# Altium project central_unit_projekt.PrjPcb
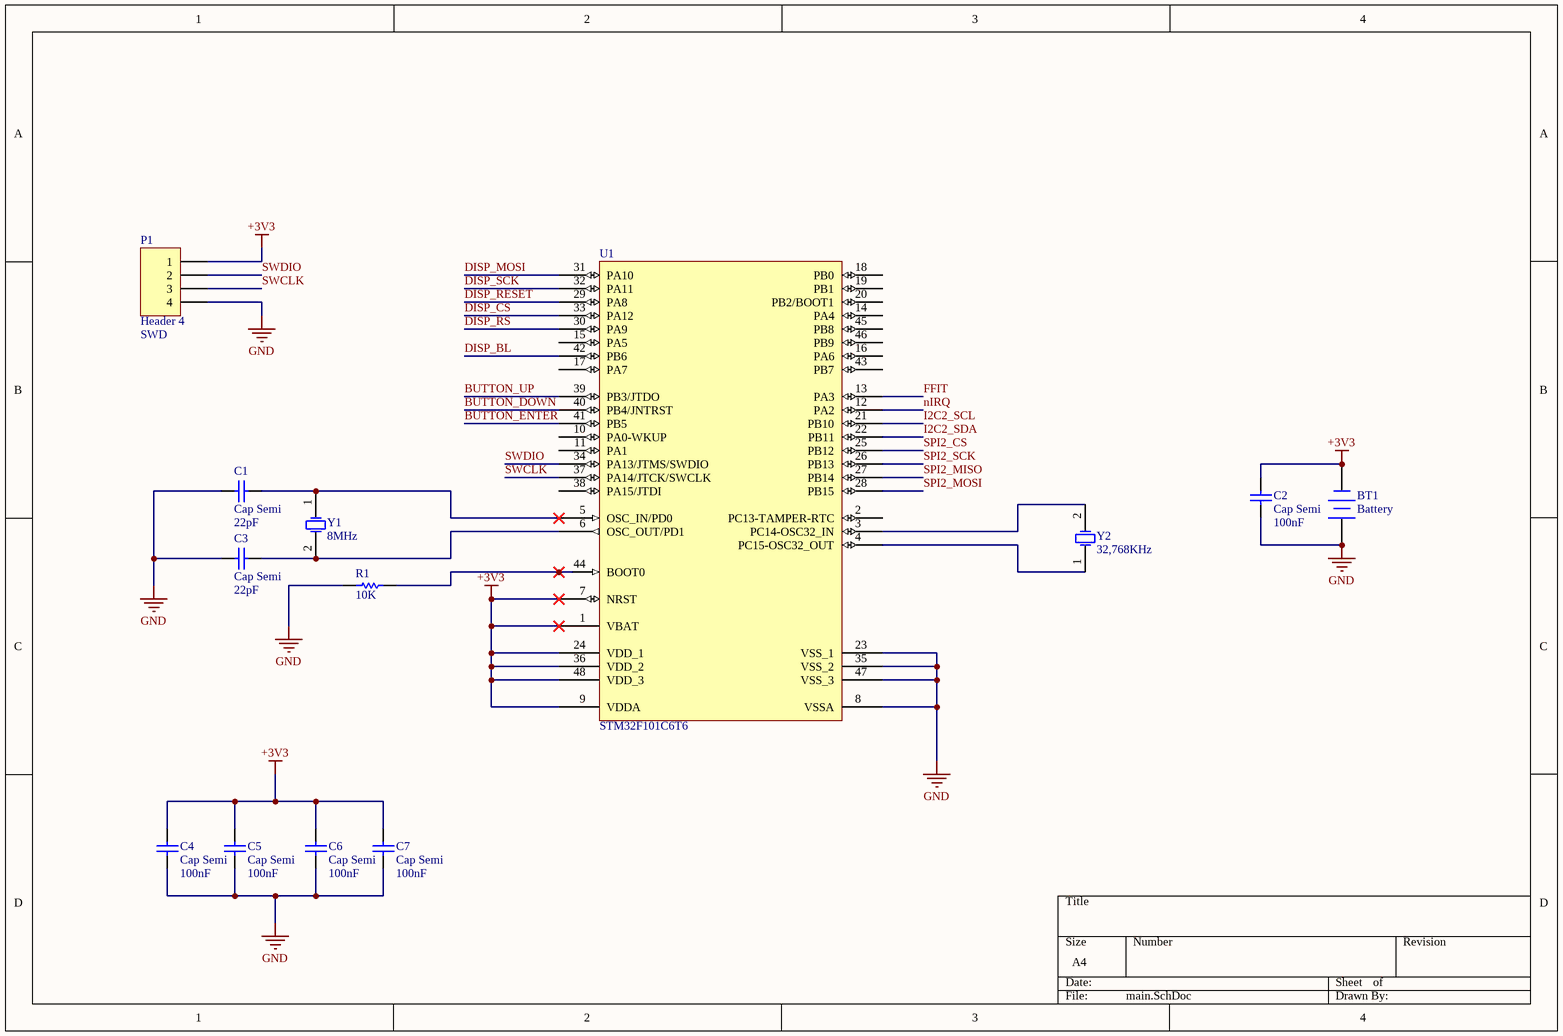
[diagram p0: main.SchDoc]
2 sheets, 23 parts. Net scope: global (net labels, ports and power ports of the same name join across sheets).
Board file: fosna.PcbDoc
Sheets:
  main.SchDoc
  rfm.SchDoc

## Sheet main.SchDoc
size A4

### Parts
BT1  Battery  [BAT-2]
C1  Cap Semi  value 22pF  [CAPC3216L]
C2  Cap Semi  value 100nF  [CAPC3216L]
C3  Cap Semi  value 22pF  [CAPC3216L]
C4  Cap Semi  value 100nF  [CAPC3216L]
C5  Cap Semi  value 100nF  [CAPC3216L]
C6  Cap Semi  value 100nF  [CAPC3216L]
C7  Cap Semi  value 100nF  [CAPC3216L]
P1  Header 4  Comment_1: SWD  [HDR1X4]
R1  value 10K  [RESC2012L]  (hidden comment: Res Semi)
U1  STM32F101C6T6  [LQFP48_L]
Y1  8MHz  [HC-49U]
Y2  32,768KHz  [BCY-W2/D3.1]

### Nets
+3V3: BT1.2(-) C2.2 C4.2 C5.2 C6.2 C7.2 P1.1 U1.1(VBAT) U1.7(NRST) U1.9(VDDA) U1.24(VDD_1) U1.36(VDD_2) U1.48(VDD_3)
GND: BT1.1(+) C1.2 C2.1 C3.2 C4.1 C5.1 C6.1 C7.1 P1.4 R1.2 U1.8(VSSA) U1.23(VSS_1) U1.35(VSS_2) U1.47(VSS_3)
BUTTON_DOWN: U1.40(PB4/JNTRST)
BUTTON_ENTER: U1.41(PB5)
BUTTON_UP: U1.39(PB3/JTDO)
DISP_BL: U1.42(PB6)
DISP_CS: U1.33(PA12)
DISP_MOSI: U1.31(PA10)
DISP_RESET: U1.29(PA8)
DISP_RS: U1.30(PA9)
DISP_SCK: U1.32(PA11)
FFIT: U1.13(PA3)
I2C2_SCL: U1.21(PB10)
I2C2_SDA: U1.22(PB11)
nIRQ: U1.12(PA2)
SPI2_CS: U1.25(PB12)
SPI2_MISO: U1.27(PB14)
SPI2_MOSI: U1.28(PB15)
SPI2_SCK: U1.26(PB13)
SWCLK: P1.3 U1.37(PA14/JTCK/SWCLK)
SWDIO: P1.2 U1.34(PA13/JTMS/SWDIO)
NetC1_1: C1.1 U1.5(OSC_IN/PD0) Y1.1(OSC1)
NetC3_1: C3.1 U1.6(OSC_OUT/PD1) Y1.2(OSC2)
NetR1_1: R1.1 U1.44(BOOT0)
NetU1_3: U1.3(PC14-OSC32_IN) Y2.2(OSC2)
NetU1_4: U1.4(PC15-OSC32_OUT) Y2.1(OSC1)

Not connected (* = marked no-connect by the designer): U1 2(PC13-TAMPER-RTC) 10(PA0-WKUP) 11(PA1) 14(PA4) 15(PA5) 16(PA6) 17(PA7) 18(PB0) 19(PB1) 20(PB2/BOOT1) 38(PA15/JTDI) 43(PB7) 45(PB8) 46(PB9)

### Library data of the parts
BT1 = Battery: Multicell Battery; Published: 24-Mar-1999; LatestRevisionDate: 17-Jul-2002; LatestRevisionNote: Re-released for DXP Platform.; PackageReference: BAT-2; Publisher: Altium Limited
C1-C7 = Cap Semi: Capacitor (Semiconductor SIM Model); Published: 8-Jun-2000; LatestRevisionDate: 29-May-2009; LatestRevisionNote: IPC-7351 Footprint Added.; PackageReference: C1206; Publisher: Altium Limited; PackageDescription: Chip Capacitor
P1 = Header 4: Header, 4-Pin; LatestRevisionDate: 17-Jul-2002; LatestRevisionNote: Re-released for DXP Platform.; Publisher: Altium Limited
R1 = Res Semi: Semiconductor Resistor; Published: 8-Jun-2000; LatestRevisionDate: 17-Jul-2002; LatestRevisionNote: Re-released for DXP Platform.; PackageReference: AXIAL-0.5; Publisher: Altium Limited
U1 = STM32F101C6T6: STM32 ARM-based 32-bit MCU with 32 Kbytes Flash, 48-pin LQFP, Industrial Temperature; Published: 30-May-2008; DatasheetVersion: rev6, Mar-2008; PackageVersion: Mar-2008; PackageReference: LQFP48; Publisher: Altium Limited; PackageDescription: 48-Pin Low-Profile Quad Flat Pack, 7 x 7 mm Body, 0.5 mm Pitch (LQFP48); ComponentLink1Description: Manufacturer Link; ComponentLink1URL: www.st.com/stm32; ComponentLink2Description: Datasheet; ComponentLink2URL: http://www.st.com/stonline/products/literature/ds/13586.pdf
Y1 = ECS-10-13-1: Crystal Oscillator; Published: 17-Jul-2002; DatasheetDocument: 18-Apr-2000; PackageReference: HC-49U; Publisher: Altium Limited; ComponentLink1Description: Manufacturer Link; ComponentLink1URL: http://www.ecsxtal.com/; ComponentLink2Description: Datasheet; ComponentLink2URL: http://www.ecsxtal.com/pdf2/HC49U.PDF
Y2 = XTAL: Crystal Oscillator; Published: 8-Jun-2000; LatestRevisionDate: 17-Jul-2002; LatestRevisionNote: Re-released for DXP Platform.; PackageReference: R38; Publisher: Altium Limited

## Sheet rfm.SchDoc
size A4
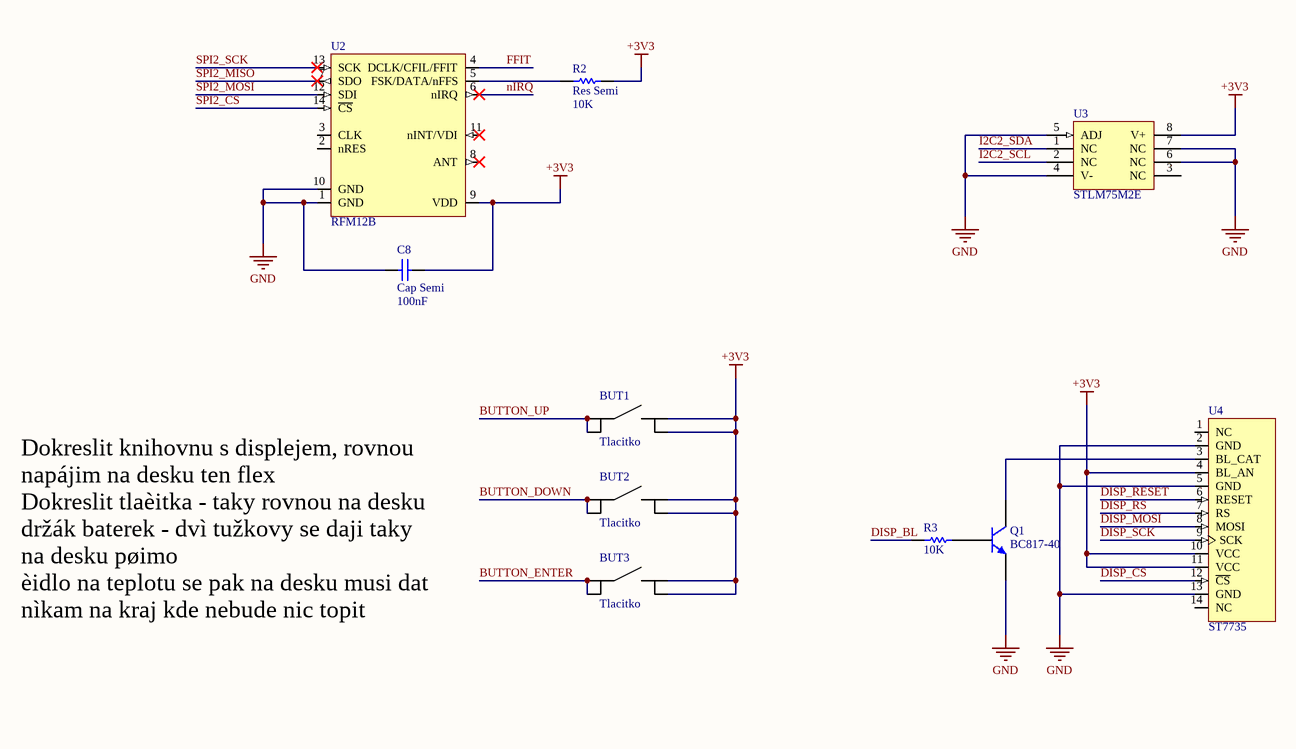
[diagram p1: rfm.SchDoc]

### Parts
BUT1  Tlacitko  [TLACITKO]
BUT2  Tlacitko  [TLACITKO]
BUT3  Tlacitko  [TLACITKO]
C8  Cap Semi  value 100nF  [CAPC3216L]
Q1  BC817-40  [SOT-23A]
R2  Res Semi  value 10K  [RESC2012L]
R3  value 10K  [RESC2012L]  (hidden comment: Res Semi)
U2  RFM12B  [PCBComponent_1]
U3  STLM75M2E  [SO8_M]
U4  ST7735  [ST7735_DESKA]

### Nets
+3V3: BUT1.3 BUT1.4 BUT2.3 BUT2.4 BUT3.3 BUT3.4 C8.1 R2.2 U2.9(VDD) U3.8(V+) U4.4(BL_AN) U4.10(VCC) U4.11(VCC)
GND: C8.2 Q1.2(E) U2.1(GND) U2.10(GND) U3.4(V-) U3.5(ADJ) U3.6(NC) U3.7(NC) U4.2(GND) U4.5(GND) U4.13(GND)
BUTTON_DOWN: BUT2.1 BUT2.2
BUTTON_ENTER: BUT3.1 BUT3.2
BUTTON_UP: BUT1.1 BUT1.2
DISP_BL: R3.2
DISP_CS: U4.12(~{CS})
DISP_MOSI: U4.8(MOSI)
DISP_RESET: U4.6(RESET)
DISP_RS: U4.7(RS)
DISP_SCK: U4.9(SCK)
FFIT: U2.4(DCLK/CFIL/FFIT)
I2C2_SCL: U3.2(NC)
I2C2_SDA: U3.1(NC)
nIRQ: U2.6(nIRQ)
SPI2_CS: U2.14(~{CS})
SPI2_MISO: U2.7(SDO)
SPI2_MOSI: U2.12(SDI)
SPI2_SCK: U2.13(SCK)
NetQ1_1: Q1.1(B) R3.1
NetQ1_3: Q1.3(C) U4.3(BL_CAT)
NetR2_1: R2.1 U2.5(FSK/DATA/nFFS)

Not connected (* = marked no-connect by the designer): U2 2(nRES) 3(CLK) 8(ANT)* 11(nINT/VDI)*; U3 3(NC); U4 1(NC) 14(NC)

### Notes on the sheet
- Dokreslit knihovnu s displejem, rovnou napájim na desku ten flex
  Dokreslit tlaèitka - taky rovnou na desku
  držák baterek - dvì tužkovy se daji taky na desku pøimo
  èidlo na teplotu se pak na desku musi dat nìkam na kraj kde nebude nic topit

### Library data of the parts
C8 = Cap Semi: Capacitor (Semiconductor SIM Model); Published: 8-Jun-2000; LatestRevisionDate: 29-May-2009; LatestRevisionNote: IPC-7351 Footprint Added.; PackageReference: C1206; Publisher: Altium Limited; PackageDescription: Chip Capacitor
Q1 = BC817-40: NPN General Purpose Amplifier; Published: 8-Jun-2000; LatestRevisionDate: 17-Jul-2002; LatestRevisionNote: Re-released for DXP Platform.; DatasheetDocument: 1997; PackageDocument: Sep-1998; PackageReference: SOT-23A; Publisher: Altium Limited; ComponentLink1Description: Manufacturer Link; ComponentLink1URL: http://www.fairchildsemi.com/; ComponentLink2Description: Discontinuation Notice; ComponentLink2URL: http://www.fairchildsemi.com/obsolete/obs.jsp
R2 R3 = Res Semi: Semiconductor Resistor; Published: 8-Jun-2000; LatestRevisionDate: 17-Jul-2002; LatestRevisionNote: Re-released for DXP Platform.; PackageReference: AXIAL-0.5; Publisher: Altium Limited
U3 = LM335AD: Precision Temperature Sensor; Published: 24-Aug-2001; LatestRevisionDate: 13-Apr-2006; LatestRevisionNote: IPC-7351 Footprint Added.; DatasheetVersion: Oct-1997; PackageVersion: Dec-2002; PackageReference: SO8; Publisher: Altium Limited; PackageDescription: 8-Pin Small Outline Integrated Circuit 1.27 mm Pitch; Code_JEDEC: MS-012-AA; Code_IPC: SOIC127P600-8; ComponentLink1Description: Manufacturer Link; ComponentLink1URL: http://www.st.com/; ComponentLink2Description: Datasheet; ComponentLink2URL: http://www.st.com/stonline/products/literature/ds/2158/lm235.pdf

## Nets that join several sheets
+3V3: main (13 pins), rfm (13 pins)
GND: main (14 pins), rfm (11 pins)
BUTTON_DOWN: main (U1.40), rfm (BUT2.1 BUT2.2)
BUTTON_ENTER: main (U1.41), rfm (BUT3.1 BUT3.2)
BUTTON_UP: main (U1.39), rfm (BUT1.1 BUT1.2)
DISP_BL: main (U1.42), rfm (R3.2)
DISP_CS: main (U1.33), rfm (U4.12)
DISP_MOSI: main (U1.31), rfm (U4.8)
DISP_RESET: main (U1.29), rfm (U4.6)
DISP_RS: main (U1.30), rfm (U4.7)
DISP_SCK: main (U1.32), rfm (U4.9)
FFIT: main (U1.13), rfm (U2.4)
I2C2_SCL: main (U1.21), rfm (U3.2)
I2C2_SDA: main (U1.22), rfm (U3.1)
nIRQ: main (U1.12), rfm (U2.6)
SPI2_CS: main (U1.25), rfm (U2.14)
SPI2_MISO: main (U1.27), rfm (U2.7)
SPI2_MOSI: main (U1.28), rfm (U2.12)
SPI2_SCK: main (U1.26), rfm (U2.13)